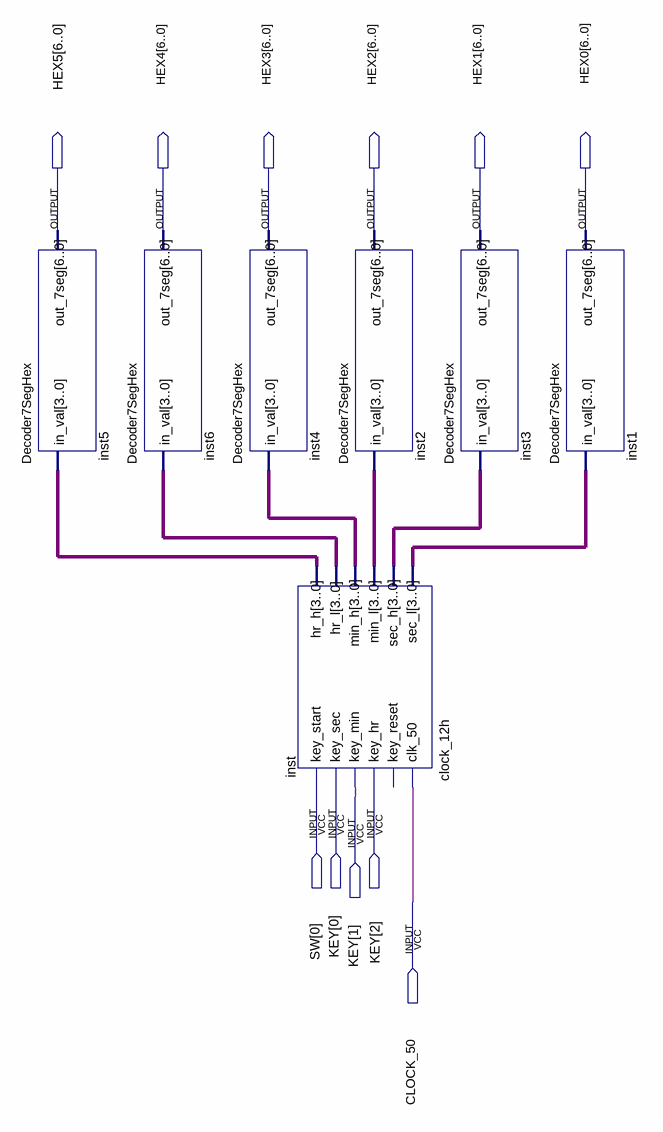
[diagram p0: schematic sheet]
// Quartus schematic 12h_clock.bdf as structural Verilog: 7 symbols, 11 pins
module \12h_clock  (
  input  [0:0] SW,
  input  [2:0] KEY,
  input  CLOCK_50,
  output [6:0] HEX5,
  output [6:0] HEX4,
  output [6:0] HEX3,
  output [6:0] HEX2,
  output [6:0] HEX1,
  output [6:0] HEX0
);

  wire [3:0] inst_hr_h, inst_hr_l, inst_min_h, inst_min_l, inst_sec_h, inst_sec_l;

  Decoder7SegHex inst5 (.in_val(inst_hr_h), .out_7seg(HEX5));
  Decoder7SegHex inst6 (.in_val(inst_hr_l), .out_7seg(HEX4));
  Decoder7SegHex inst4 (.in_val(inst_min_h), .out_7seg(HEX3));
  clock_12h inst (
    .clk_50(CLOCK_50), .key_hr(KEY[2]), .key_min(KEY[1]), .key_sec(KEY[0]), .key_start(SW[0]),
    .sec_l(inst_sec_l), .sec_h(inst_sec_h), .min_l(inst_min_l), .min_h(inst_min_h), .hr_l(inst_hr_l),
    .hr_h(inst_hr_h));  // open: key_reset
  Decoder7SegHex inst2 (.in_val(inst_min_l), .out_7seg(HEX2));
  Decoder7SegHex inst3 (.in_val(inst_sec_h), .out_7seg(HEX1));
  Decoder7SegHex inst1 (.in_val(inst_sec_l), .out_7seg(HEX0));
endmodule
